# EAGLE design p2gpl-001 (EAGLE 9.6.2)
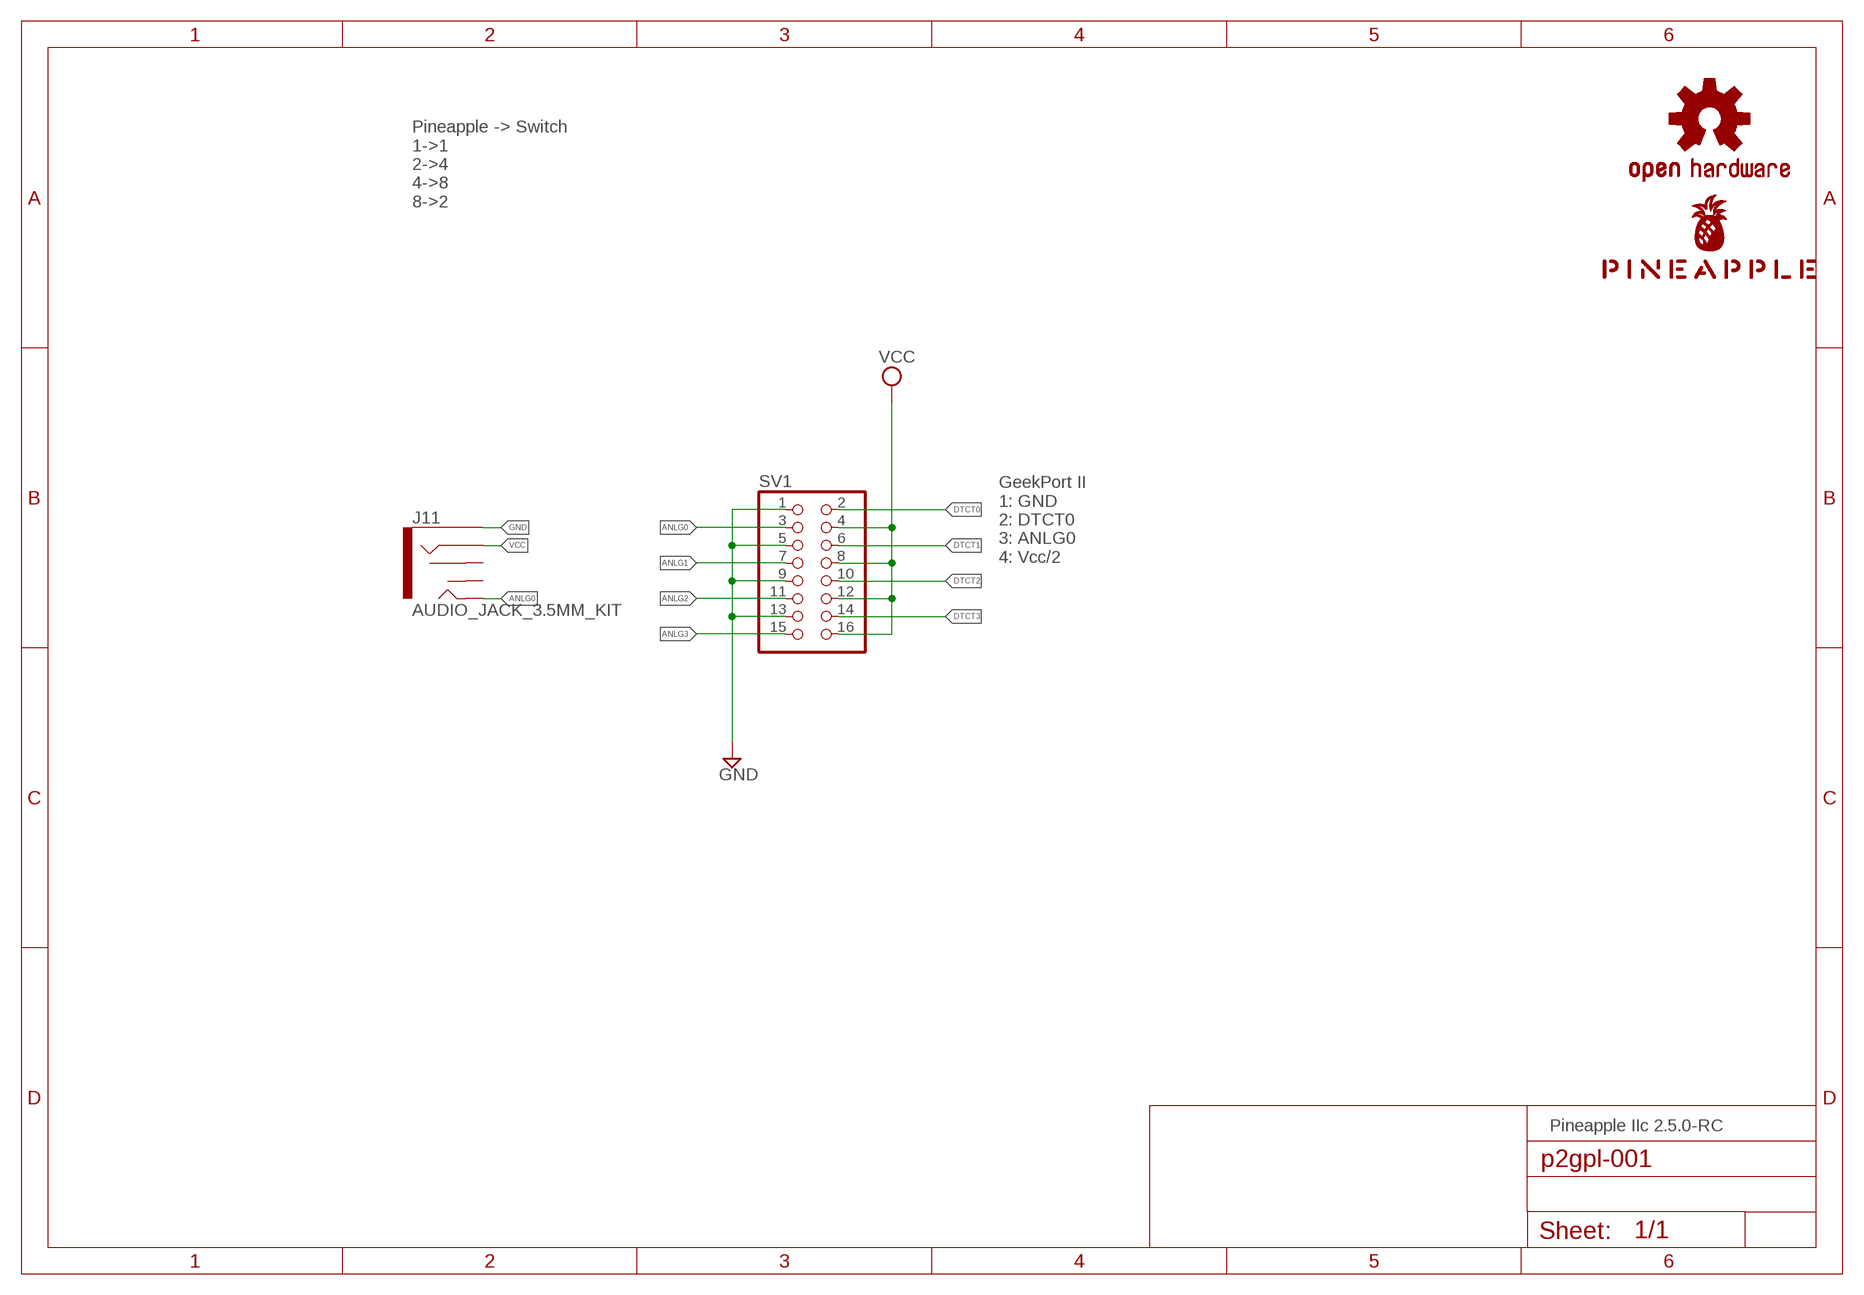
[diagram p0: schematic, sheet 1]

## Parts
J11  AUDIO_JACK_3.5MM_KIT  [AUDIO-JACK-KIT]
LOGO1  OSHW-LOGOS-COPPER  [OSHW-LOGO-S_COPPER]
SV1  PINHD-2X8  [2X08]
U$1  PINEAPPLE450_SILK  [PINEAPPLE450_SILK]

## Nets
ANLG0: J11.TIP SV1.3
ANLG1: SV1.7
ANLG2: SV1.11
ANLG3: SV1.15
DTCT0: SV1.2
DTCT1: SV1.6
DTCT2: SV1.10
DTCT3: SV1.14
GND: J11.SLEEVE SV1.1 SV1.5 SV1.9 SV1.13
VCC: J11.RING SV1.4 SV1.8 SV1.12 SV1.16
Unconnected: J11.RSH J11.TSH

## Notes on the sheet
- Pineapple -> Switch
  1->1
  2->4
  4->8
  8->2
- GeekPort II
  1: GND
  2: DTCT0
  3: ANLG0
  4: Vcc/2
- Pineapple IIc 2.5.0-RC

## Library data of the parts
J11 = SparkFun-Connectors:AUDIO_JACK_3.5MM: Audio Jack 3.5mm variants of PTH and SMT stereo audio jack with bypass switches. SparkFun Products: SparkFun SparkPunk Sound Kit <[https://www.sparkfun.com/products/11177]> - PTH MP3 Trigger <https://www.sparkfun.com/products/13720> -3.5mm SMD SparkFun PicoBoard <https://www.sparkfun.com/products/11888>- 2.5mm SMD; PROD_ID: CONN-08774; SF_ID: PRT-08032
LOGO1 = SparkFun-Aesthetics:OSHW-LOGO: Open-Source Hardware (OSHW) Logo This logo indicates the piece of hardware it is found on incorporates a OSHW license and/or adheres to the definition of open source hardware found here: http://freedomdefined.org/OSHW
SV1 = pinhead:PINHD-2X8: PIN HEADER
U$1 = pineapple:PINEAPPLE450_SILK

## Net classes
0 default: width 0.152 mm, drill 0.152 mm, clearance 0.152 mm
1 ground: width 0.305 mm, drill 0.152 mm, clearance 0.152 mm
2 power1: width 0.508 mm, drill 0.152 mm, clearance 0.152 mm
3 power2: width 0.61 mm, drill 0.152 mm, clearance 0.152 mm
4 analog: width 0.305 mm, drill 0.152 mm, clearance 0.152 mm
5 external: width 0.152 mm, drill 0.152 mm, clearance 0.152 mm

## Board
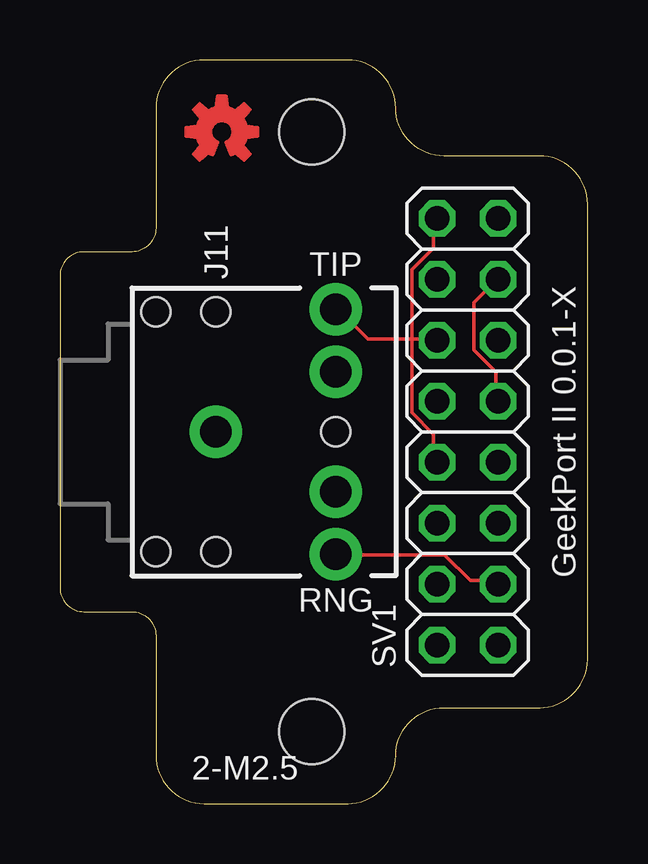
[diagram p1: board, top side]
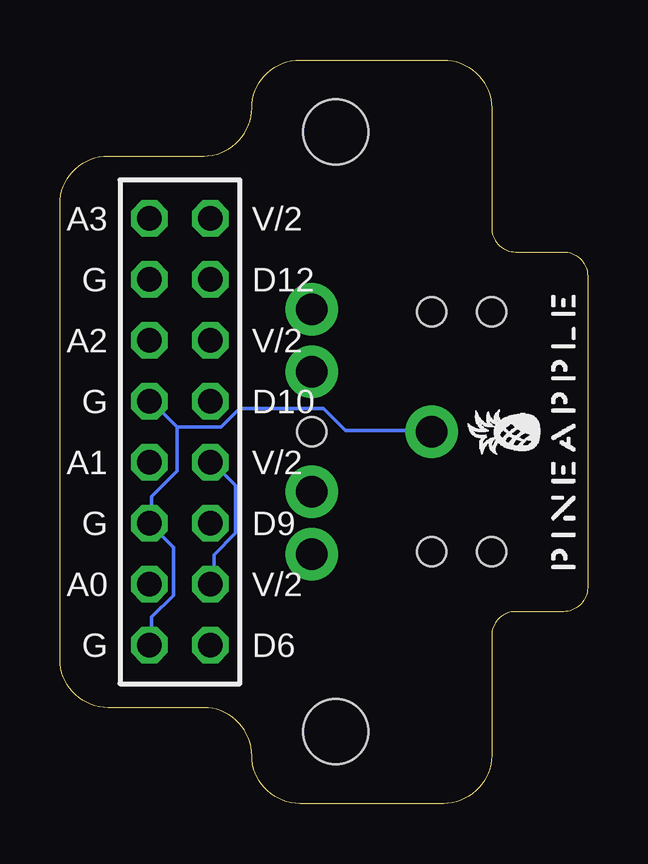
[diagram p2: board, bottom side, seen from below]

Size 22 x 31 mm. Coordinates in mm from the lower left corner, seen from the top.
Outline: 4,29 4,24 arc-90 3,23 1,23 arc90 0,22 0,9 arc90 1,8 3,8 arc-90 4,7 4,2 arc90 6,0 12,0 arc90 14,2 arc-90 16,4 20,4 arc90 22,6 22,25 arc90 20,27 16,27 arc-90 14,29 arc90 12,31 6,31 arc90 4,29
Copper layers (1*16): Top 0.035mm / dielectric 1.5mm / Bottom 0.035mm
Design rules "SeeedStudio_2layer_DRU_no_angle_20140221": minimum track width 6mil, minimum drill 12mil, track to track 6mil, track to pad 6mil, pad to pad 6mil, via to via 6mil, smd to smd 0mil, copper to edge 10mil, drill to drill 10mil, minimum pad ring 10mil, minimum via ring 6mil, stop-mask expansion 2mil, vias tented up to drill 100mil, thermal gap 10mil
Holes 2.7 mm at 10.5,3 10.5,28
tRestrict: area 8.5,1 to 12.5,5; area 8.5,26 to 12.5,30; area 0,8 to 1,23; area 4,30 to 14,31; area 13,26 to 14,31; area 13,26 to 22,27; area 21,4 to 22,27; area 13,4 to 22,5; area 13,0 to 14,5; area 4,0 to 14,1; area 4,0 to 5,9; area 4,22 to 5,31; 2 more areas
bRestrict: area 4,0 to 14,1; area 21,4 to 22,27; area 4,30 to 14,31; area 0,8 to 1,23; area 8.5,1 to 12.5,5; area 8.5,26 to 12.5,30; area 13,26 to 22,27; area 13,4 to 22,5; area 13,0 to 14,5; area 13,26 to 14,31; area 4,0 to 5,9; area 4,22 to 5,31; 2 more areas

### Footprints (pad centres in the part's own frame; a part is rotated, then mirrored left to right if it is on the bottom)
AUDIO-JACK-KIT = drill 1.3 pad 2.184: RING 5,5.1; RSH 5,2.5; SLEEVE 0,0; TIP 5,-5.1; TSH 5,-2.5 | hole 1.2: 0,5; -2.5,5; -2.5,-5; 0,-5; 5,0
2X08 = drill 1.016 octagon: 1 -8.89,-1.27; 2 -8.89,1.27; 3 -6.35,-1.27; 4 -6.35,1.27; 5 -3.81,-1.27; 6 -3.81,1.27; 7 -1.27,-1.27; 8 -1.27,1.27; 9 1.27,-1.27; 10 1.27,1.27; 11 3.81,-1.27; 12 3.81,1.27; 13 6.35,-1.27; 14 6.35,1.27; 15 8.89,-1.27; 16 8.89,1.27

### Placement (x,y rotation side)
J11  6.5,15.5 0 top
LOGO1  6.75,28 0 top
SV1  17,15.5 90 top
U$1  0.5,15.5 90 bottom

### Tracks (layer width: path | path; a pad name or v marks a point on that pad's centre or on a via)
ANLG0
  Top 0.152: SV1.3 18.17,9.3 17.11,9.3 16.04,10.36 11.62,10.36 J11.TIP
GND
  Top 0.152: SV1.9 18.17,16.92 18.17,17.98 17.26,18.9 17.26,20.88 18.17,21.79 SV1.13
  Bottom 0.152: SV1.1 18.17,6.71 18.17,7.77 17.26,8.69 17.26,10.67 18.17,11.58 SV1.5 18.17,11.73 18.17,12.8 17.11,13.87 17.11,15.7 | 17.11,15.7 15.28,15.7 14.52,16.46 11.01,16.46 10.1,15.54 6.59,15.54 J11.SLEEVE | 17.11,15.7 18.17,16.76 SV1.9
VCC
  Top 0.152: 14.67,19.36 12.84,19.36 11.62,20.57 J11.RING | 14.67,19.36 15.58,19.36 SV1.12 | 14.67,19.36 14.67,22.25 15.58,23.16 15.58,24.38 SV1.16 | 14.67,19.36 14.67,16.31 15.58,15.39 15.58,14.33 SV1.8
  Bottom 0.152: SV1.4 15.58,9.3 15.58,10.36 14.67,11.28 14.67,13.26 15.58,14.17 SV1.8

### Text on the board
tNames: TIP | GeekPort II 0.0.1-X | RNG | 2-M2.5
bNames: V/2 | A3 | D12 | G | V/2 | A2 | D10 | G | V/2 | A1 | D9 | G | V/2 | A0 | D6 | G